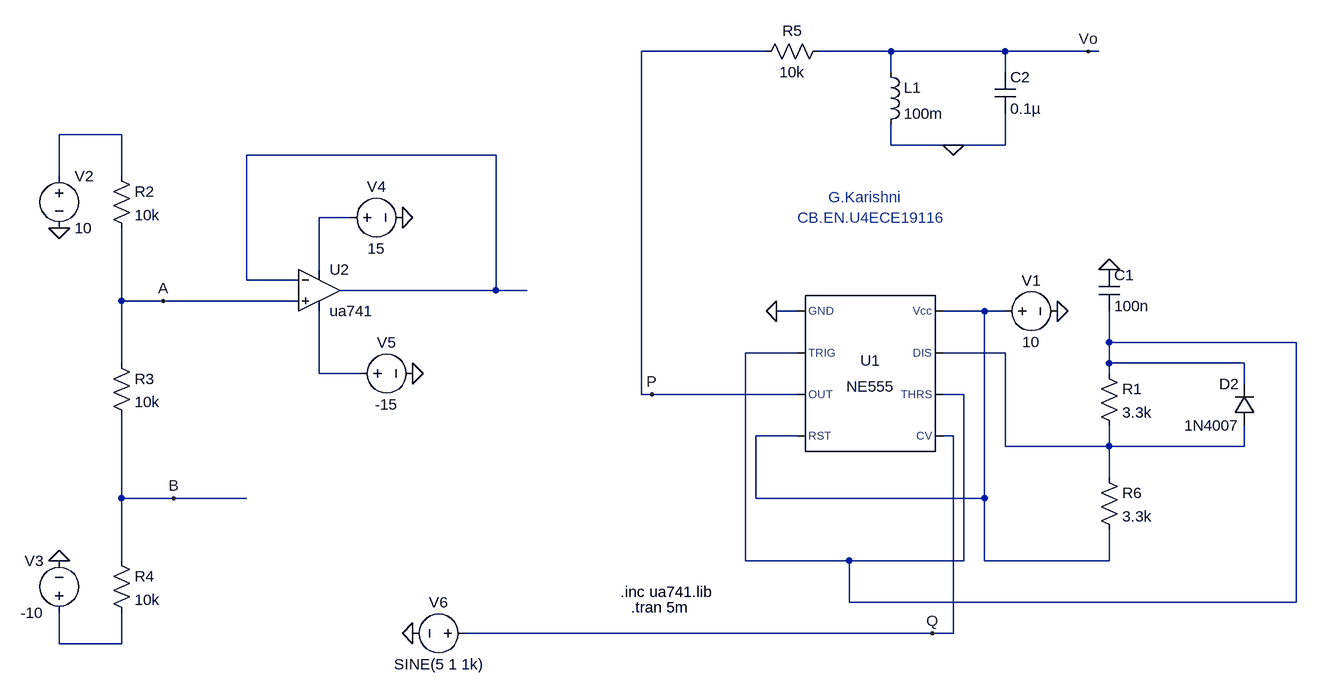
[diagram p0: schematic Draft2.asc]
Draft2.asc, the LTspice schematic file:
Version 4
SHEET 1 1412 880
WIRE 592 -160 400 -160
WIRE 784 -160 672 -160
WIRE 960 -160 784 -160
WIRE 1088 -160 960 -160
WIRE 1104 -160 1088 -160
WIRE 784 -128 784 -160
WIRE 960 -128 960 -160
WIRE -400 -32 -496 -32
WIRE 784 -16 784 -48
WIRE 880 -16 784 -16
WIRE 960 -16 960 -64
WIRE 960 -16 880 -16
WIRE 176 0 -208 0
WIRE -496 32 -496 -32
WIRE -400 32 -400 -32
WIRE -48 96 -96 96
WIRE -96 176 -96 96
WIRE -208 192 -208 0
WIRE -128 192 -208 192
WIRE 176 208 176 0
WIRE 176 208 -64 208
WIRE 224 208 176 208
WIRE -400 224 -400 112
WIRE -336 224 -400 224
WIRE -128 224 -336 224
WIRE 640 240 608 240
WIRE 928 240 864 240
WIRE 960 240 928 240
WIRE 1120 288 1120 240
WIRE 1408 288 1120 288
WIRE 640 304 560 304
WIRE 960 304 864 304
WIRE -400 320 -400 224
WIRE 1120 320 1120 288
WIRE 1328 320 1120 320
WIRE -96 336 -96 240
WIRE -32 336 -96 336
WIRE 1120 336 1120 320
WIRE 1328 352 1328 320
WIRE 400 368 400 -160
WIRE 416 368 400 368
WIRE 640 368 416 368
WIRE 896 368 864 368
WIRE 640 432 576 432
WIRE 880 432 864 432
WIRE 960 448 960 304
WIRE 1120 448 1120 416
WIRE 1120 448 960 448
WIRE 1328 448 1328 416
WIRE 1328 448 1120 448
WIRE 1120 496 1120 448
WIRE -400 528 -400 400
WIRE -320 528 -400 528
WIRE -208 528 -320 528
WIRE 576 528 576 432
WIRE 928 528 928 240
WIRE 928 528 576 528
WIRE -400 624 -400 528
WIRE 560 624 560 304
WIRE 720 624 560 624
WIRE 896 624 896 368
WIRE 896 624 720 624
WIRE 928 624 928 528
WIRE 1120 624 1120 576
WIRE 1120 624 928 624
WIRE 720 688 720 624
WIRE 1408 688 1408 288
WIRE 1408 688 720 688
WIRE 848 736 128 736
WIRE 880 736 880 432
WIRE 880 736 848 736
WIRE -496 752 -496 704
WIRE -400 752 -400 704
WIRE -400 752 -496 752
FLAG 1040 240 0
FLAG 608 240 0
FLAG -496 112 0
FLAG -496 624 0
FLAG 32 96 0
FLAG 48 336 0
FLAG 48 736 0
FLAG -336 224 A
FLAG -320 528 B
FLAG 1120 176 0
FLAG 416 368 P
FLAG 848 736 Q
FLAG 880 -16 0
FLAG 1088 -160 Vo
SYMBOL Misc\\NE555 752 336 R0
SYMATTR InstName U1
SYMBOL voltage 944 240 R270
WINDOW 0 32 56 VTop 2
WINDOW 3 -32 56 VBottom 2
WINDOW 123 0 0 Left 0
WINDOW 39 0 0 Left 0
SYMATTR InstName V1
SYMATTR Value 10
SYMBOL res -416 304 R0
SYMATTR InstName R3
SYMATTR Value 10k
SYMBOL res -416 608 R0
SYMATTR InstName R4
SYMATTR Value 10k
SYMBOL voltage -496 16 R0
WINDOW 123 0 0 Left 0
WINDOW 39 0 0 Left 0
SYMATTR InstName V2
SYMATTR Value 10
SYMBOL voltage -496 720 R180
WINDOW 0 24 96 Left 2
WINDOW 3 24 16 Left 2
WINDOW 123 0 0 Left 0
WINDOW 39 0 0 Left 0
SYMATTR InstName V3
SYMATTR Value -10
SYMBOL res -416 16 R0
SYMATTR InstName R2
SYMATTR Value 10k
SYMBOL OpAmps\\ua741 -96 144 R0
SYMATTR InstName U2
SYMBOL voltage -64 96 R270
WINDOW 0 32 56 VTop 2
WINDOW 3 -32 56 VBottom 2
WINDOW 123 0 0 Left 0
WINDOW 39 0 0 Left 0
SYMATTR InstName V4
SYMATTR Value 15
SYMBOL voltage -48 336 R270
WINDOW 0 32 56 VTop 2
WINDOW 3 -32 56 VBottom 2
WINDOW 123 0 0 Left 0
WINDOW 39 0 0 Left 0
SYMATTR InstName V5
SYMATTR Value -15
SYMBOL voltage 144 736 R90
WINDOW 0 -32 56 VBottom 2
WINDOW 3 32 56 VTop 2
WINDOW 123 0 0 Left 0
WINDOW 39 0 0 Left 0
SYMATTR InstName V6
SYMATTR Value SINE(5 1 1k)
SYMBOL res 1104 320 R0
SYMATTR InstName R1
SYMATTR Value 3.3k
SYMBOL res 1104 480 R0
SYMATTR InstName R6
SYMATTR Value 3.3k
SYMBOL cap 1104 176 R0
SYMATTR InstName C1
SYMATTR Value 100n
SYMBOL diode 1344 416 R180
WINDOW 0 24 64 Left 2
WINDOW 3 24 0 Left 2
SYMATTR InstName D2
SYMATTR Value 1N4007
SYMBOL res 688 -176 R90
WINDOW 0 0 56 VBottom 2
WINDOW 3 32 56 VTop 2
SYMATTR InstName R5
SYMATTR Value 10k
SYMBOL ind 768 -144 R0
SYMATTR InstName L1
SYMATTR Value 100m
SYMBOL cap 944 -128 R0
SYMATTR InstName C2
SYMATTR Value 0.1µ
TEXT 384 696 Left 2 !.tran 5m
TEXT 368 672 Left 2 !.inc ua741.lib
TEXT 688 64 Left 2 ;G.Karishni
TEXT 640 96 Left 2 ;CB.EN.U4ECE19116

The netlist it stands for:
* Draft2.asc
XU1 0 N005 P N004 Q N005 N006 N004 NE555  ; pins GND TRIG OUT RST CV THRS DIS Vcc
V1 N004 0 10
R3 A B 10k
R4 B N008 10k
V2 N001 0 10
V3 N008 0 -10
R2 N001 A 10k
XU2 A N002 N003 N007 N002 ua741  ; pins In+ In- V+ V- OUT
V4 N003 0 15
V5 N007 0 -15
V6 Q 0 SINE(5 1 1k)
R1 N005 N006 3.3k
R6 N006 N004 3.3k
C1 0 N005 100n
D2 N006 N005 1N4007
R5 Vo P 10k
L1 Vo 0 100m
C2 Vo 0 0.1µ
.model D D
.lib standard.dio
.tran 5m
.inc ua741.lib
* G.Karishni
* CB.EN.U4ECE19116
.lib NE555.sub
.backanno
.end